# EAGLE design Symposion_K3_Arduino-Peripherie-IF_v2.2 (EAGLE 9.6.2)
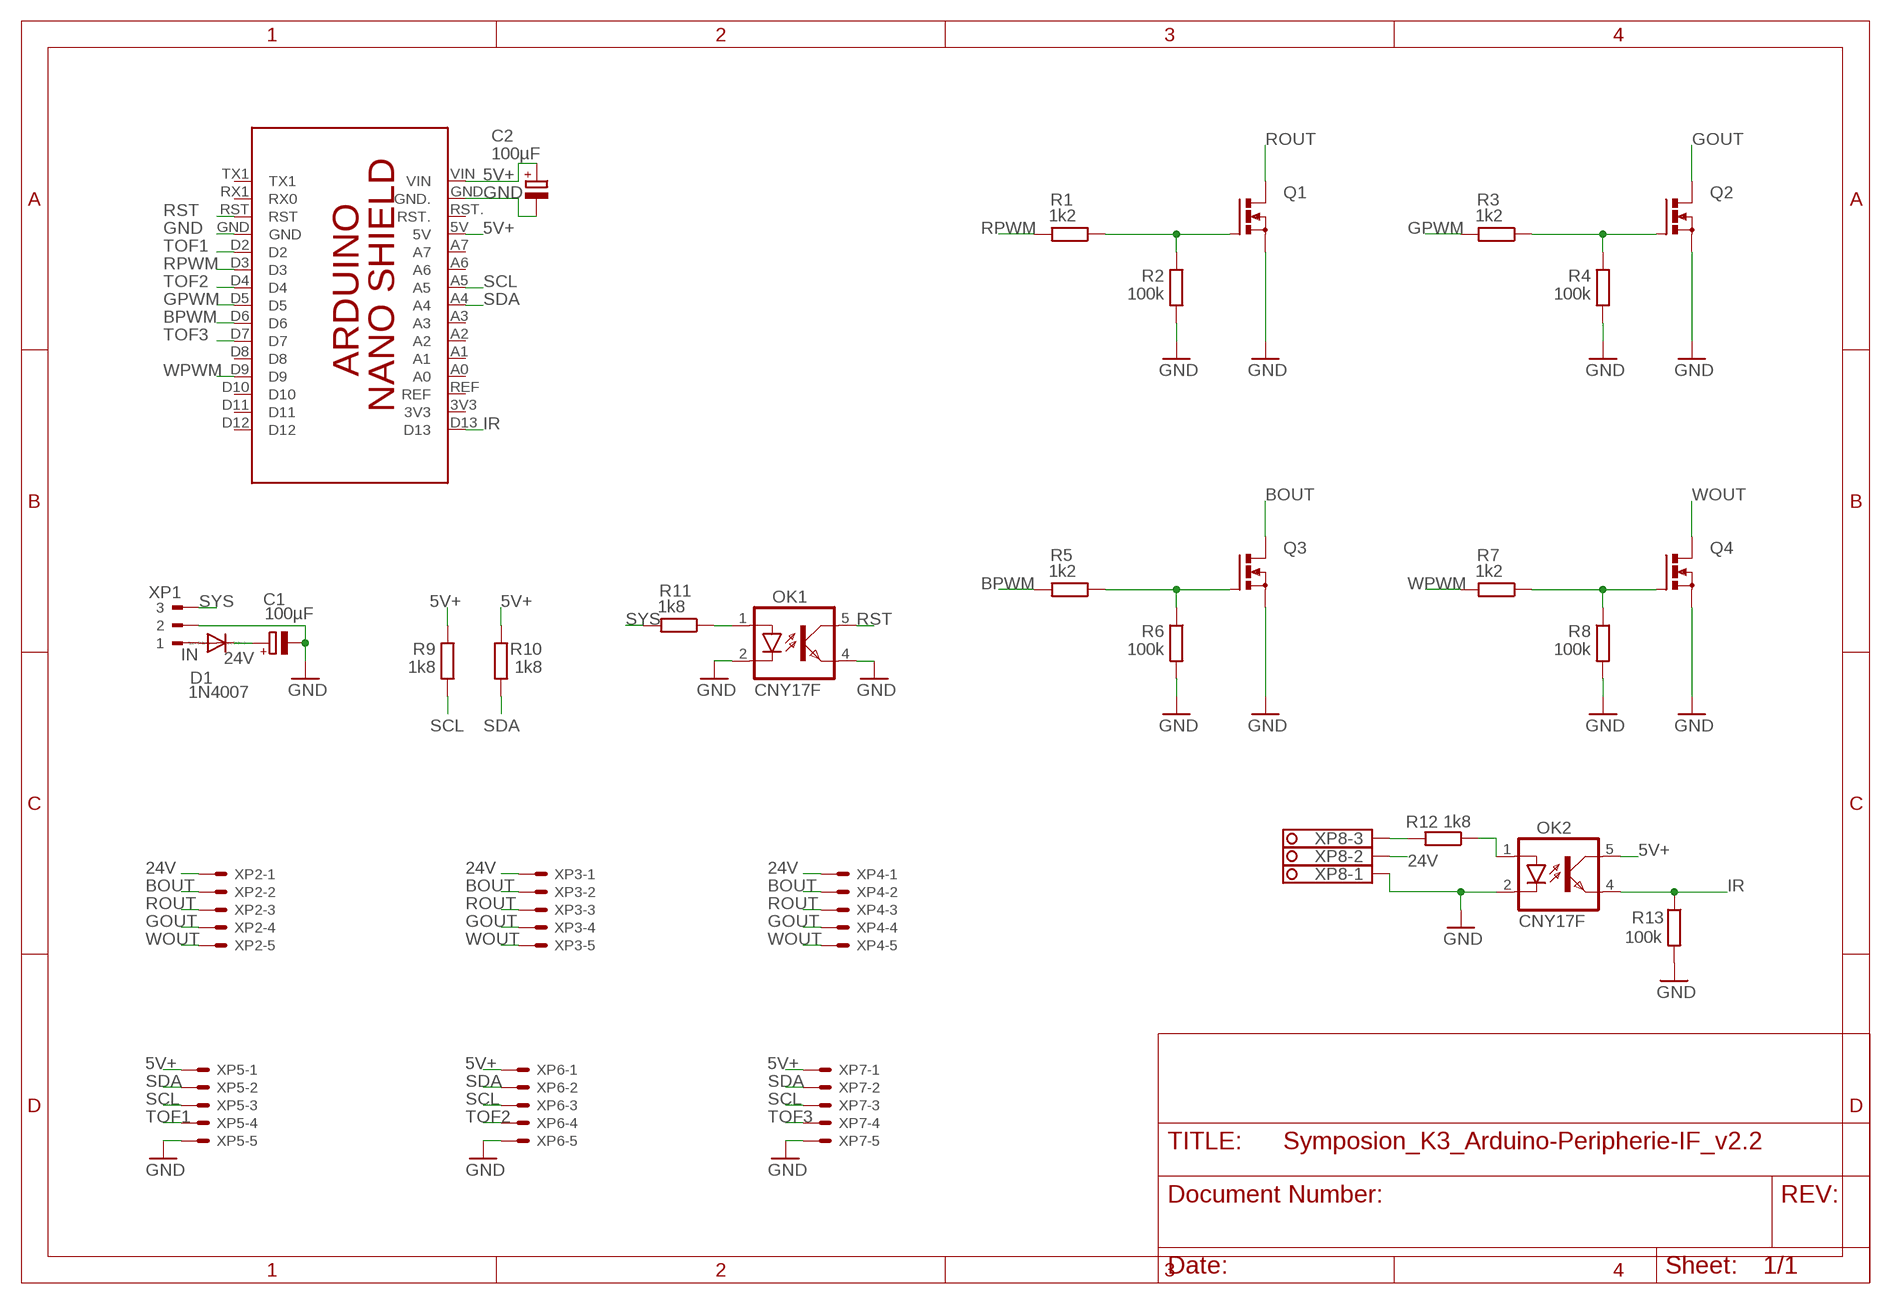
[diagram p0: schematic, sheet 1]

## Parts
C1  100µF  RCL_CPOL-EUE5-6  [RCL_E5-6]
C2  100µF  RCL_CPOL-EUE5-6  [RCL_E5-6]
D1  1N4007  DIODE_DIODE-F126-10  [DIODE_F126-10]
OK1  CNY17F  [DIL06]
OK2  CNY17F  [DIL06]
PCB1  0_WSH_FAVORITES_ARDUINO_NANO  [0_WSH_FAVORITES_ARDUINO_NANO]
Q1  0_WSH_FAVORITES_BUZ11BV  [0_WSH_FAVORITES_TO220BV]
Q2  0_WSH_FAVORITES_BUZ11BV  [0_WSH_FAVORITES_TO220BV]
Q3  0_WSH_FAVORITES_BUZ11BV  [0_WSH_FAVORITES_TO220BV]
Q4  0_WSH_FAVORITES_BUZ11BV  [0_WSH_FAVORITES_TO220BV]
R1  1k2  R-EU_R1206  [R1206]
R2  100k  R-EU_R1206  [R1206]
R3  1k2  R-EU_R1206  [R1206]
R4  100k  R-EU_R1206  [R1206]
R5  1k2  R-EU_R1206  [R1206]
R6  100k  R-EU_R1206  [R1206]
R7  1k2  R-EU_R1206  [R1206]
R8  100k  R-EU_R1206  [R1206]
R9  1k8  R-EU_R1206  [R1206]
R10  1k8  R-EU_R1206  [R1206]
R11  1k8  R-EU_R1206  [R1206]
R12  1k8  R-EU_R1206  [R1206]
R13  100k  R-EU_R1206  [R1206]
XP1  180-3  [180-3]
XP2  22-27-2051-05  [6410-05]
XP3  22-27-2051-05  [6410-05]
XP4  22-27-2051-05  [6410-05]
XP5  22-27-2051-05  [6410-05]
XP6  22-27-2051-05  [6410-05]
XP7  22-27-2051-05  [6410-05]
XP8  1751251  [1751251]

## Nets
5V+: C2.+ OK2.5(COL) PCB1.5V PCB1.VIN R9.1 R10.1 XP5.1 XP6.1 XP7.1
24V: C1.+ D1.C XP2.1 XP3.1 XP4.1 XP8.2
BOUT: Q3.D XP2.2 XP3.2 XP4.2
BPWM: PCB1.D6 R5.2
GND: C1.- C2.- OK1.2(C) OK1.4(EMIT) OK2.2(C) PCB1.GND PCB1.GND. Q1.S Q2.S Q3.S Q4.S R2.2 R4.2 R6.2 R8.2 R13.2 XP1.2 XP5.5 XP6.5 XP7.5 XP8.1
GOUT: Q2.D XP2.4 XP3.4 XP4.4
GPWM: PCB1.D5 R3.2
IN: D1.A XP1.1
IR: OK2.4(EMIT) PCB1.D13 R13.1
N$1: Q1.G R1.1 R2.1
N$2: OK1.1(A) R11.1
N$4: Q2.G R3.1 R4.1
N$7: Q3.G R5.1 R6.1
N$9: OK2.1(A) R12.1
N$10: Q4.G R7.1 R8.1
N$11: R12.2 XP8.3
ROUT: Q1.D XP2.3 XP3.3 XP4.3
RPWM: PCB1.D3 R1.2
RST: OK1.5(COL) PCB1.RST
SCL: PCB1.A5 R9.2 XP5.3 XP6.3 XP7.3
SDA: PCB1.A4 R10.2 XP5.2 XP6.2 XP7.2
SYS: R11.2 XP1.3
TOF1: PCB1.D2 XP5.4
TOF2: PCB1.D4 XP6.4
TOF3: PCB1.D7 XP7.4
WOUT: Q4.D XP2.5 XP3.5 XP4.5
WPWM: PCB1.D9 R7.2
Unconnected: PCB1.3V3 PCB1.A0 PCB1.A1 PCB1.A2 PCB1.A3 PCB1.A6 PCB1.A7 PCB1.D8 PCB1.D10 PCB1.D11 PCB1.D12 PCB1.REF PCB1.RST. PCB1.RX1(RX0) PCB1.TX1

## Library data of the parts
C1 C2 = 20221130_WSH_Eagle_Lib:RCL_CPOL-EU: POLARIZED CAPACITOR, European symbol
D1 = 20221130_WSH_Eagle_Lib:DIODE_DIODE-: DIODE
OK1 OK2 = optocoupler:CNY17F: SIEMENS OPTO COUPLER; MF: VISHAY/TELEFUNKEN; MPN: CNY17F-3; OC_FARNELL: 1469473; OC_NEWARK: 58K0172
PCB1 = 20221130_WSH_Eagle_Lib:0_WSH_FAVORITES_ARDUINO_NANO: Device for representing an Arduino Nano shield
Q1-Q4 = 20221130_WSH_Eagle_Lib:0_WSH_FAVORITES_BUZ11: N-CHANNEL MOS FET
R1-R13 = resistor:R-EU_: RESISTOR, European symbol
XP1 = con-weidmueller-sl35:180-3: WEIDMUELLER CLAMP CONNECTOR; OC_FARNELL: unknown; OC_NEWARK: unknown
XP2-XP7 = con-molex:22-?-05: CONNECTOR wire to board 2.54 mm (.1 inch) pitch header; MF: MOLEX; OC_FARNELL: unknown; OC_NEWARK: unknown
XP8 = con-phoenix-350:1751251: MKDS 1/ 3-3,5 Printklemme Nennstrom: 10 A Bemessungsspannung: 160 V Raster: 3,5 mm Polzahl: 3 Montageart: Löten Anschlussart: Schraubanschluss Anschlussrichtung vom Leiter zur Platine: 0° Source: http://eshop.phoenixcontact.com .. 1751251.pdf; OC_FARNELL: unknown; OC_NEWARK: unknown

## Board
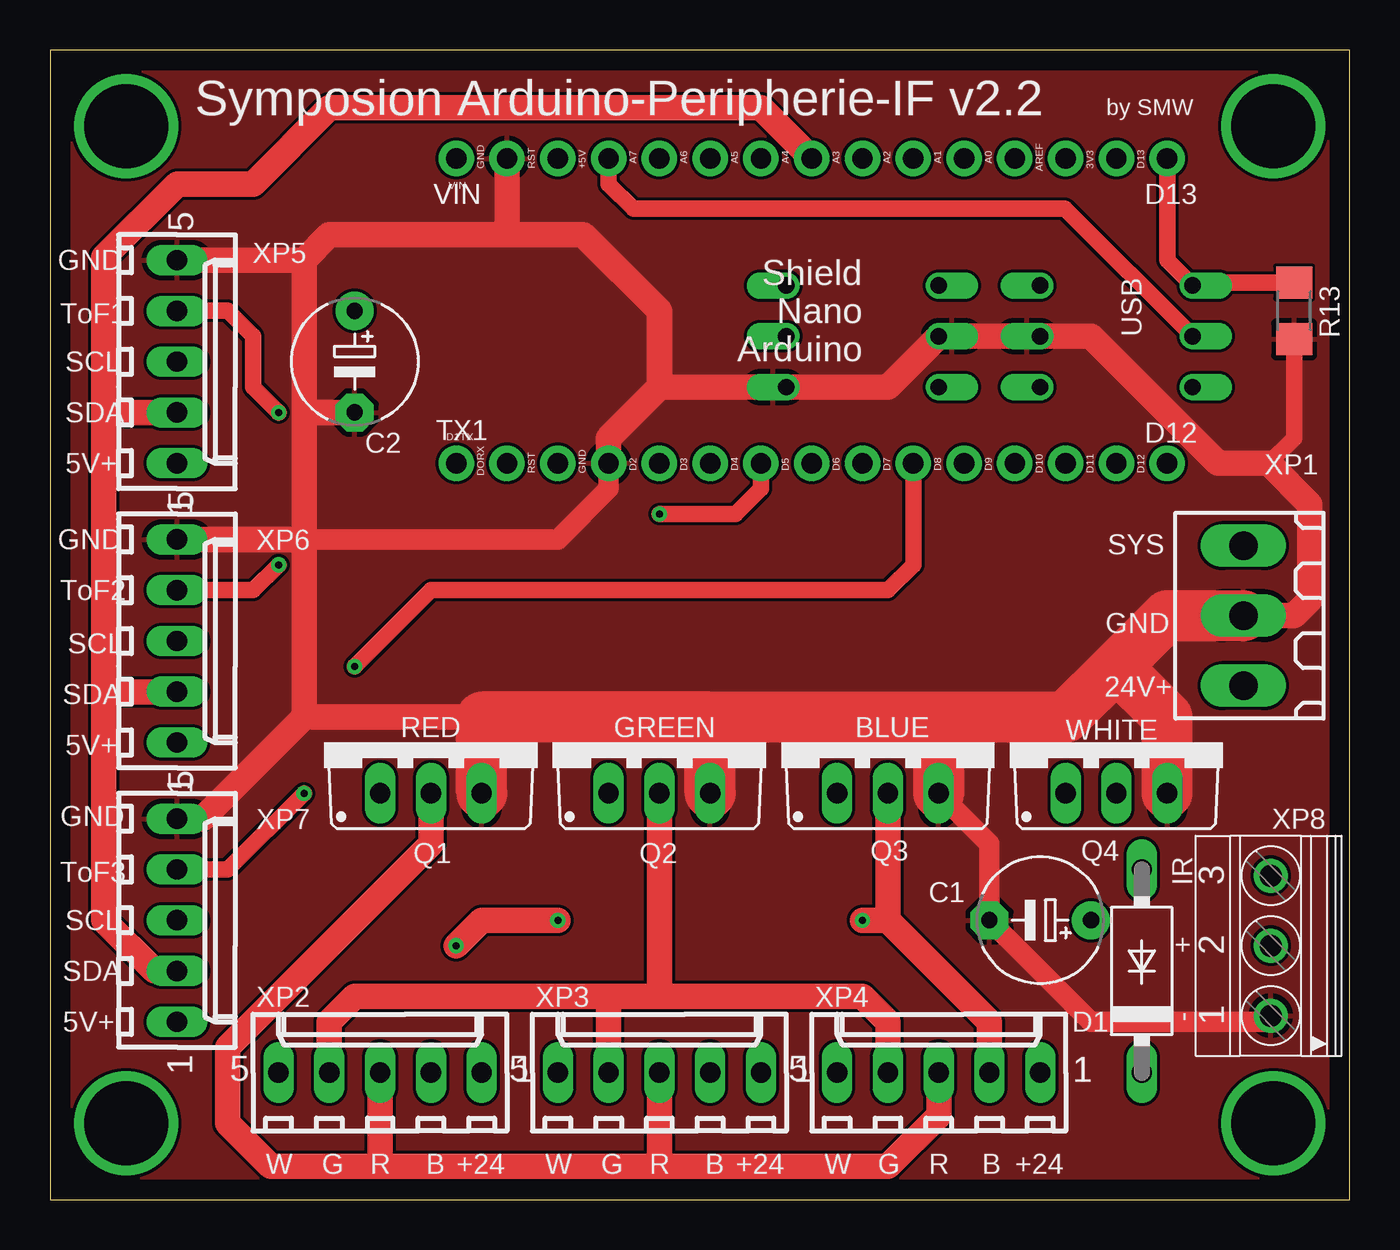
[diagram p1: board, top side]
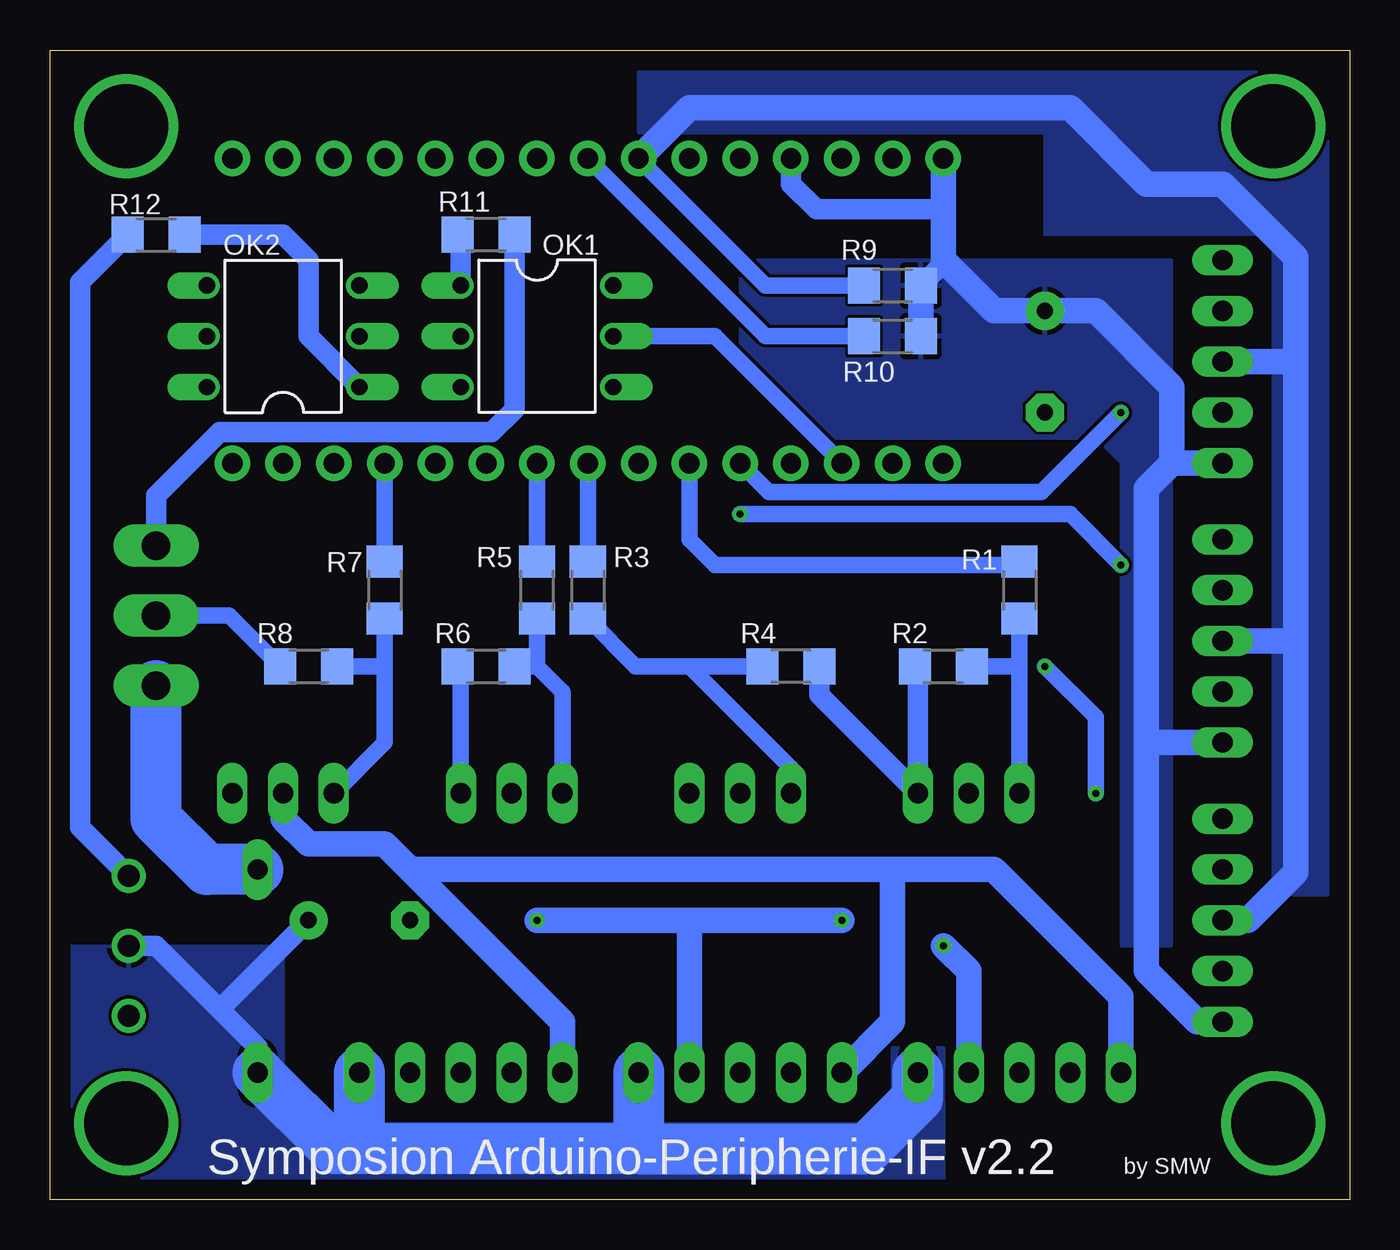
[diagram p2: board, bottom side, seen from below]

Size 65 x 57.5 mm. Coordinates in mm from the lower left corner, seen from the top.
Outline: 0,0 65,0 65,57.5 0,57.5 0,0
Copper layers (1*16): Top 0.035mm / dielectric 1.5mm / Bottom 0.035mm
Design rules "default": minimum track width 6mil, minimum drill 0.35mm, track to track 6mil, track to pad 6mil, pad to pad 6mil, via to via 6mil, smd to smd 6mil, copper to edge 40mil, drill to drill 6mil, minimum pad ring 10mil, minimum via ring 8mil, stop-mask expansion 4mil, vias tented up to drill 0mil, thermal gap 10mil

### Footprints (pad centres in the part's own frame; a part is rotated, then mirrored left to right if it is on the bottom)
RCL_E5-6 = drill 0.813 pad 1.905: + -2.54,0 | drill 0.813 pad 1.905 octagon: - 2.54,0
DIODE_F126-10 = drill 1.016 long: A 5.08,0; C -5.08,0
DIL06 = drill 0.813 offset: 1 -2.54,-3.81; 2 0,-3.81; 3 2.54,-3.81; 4 2.54,3.81; 5 0,3.81; 6 -2.54,3.81
0_WSH_FAVORITES_ARDUINO_NANO = drill 1.016 pad 1.778: 3V3 6.35,1.27; 5V 31.75,1.27; A0 11.43,1.27; A1 13.97,1.27; A2 16.51,1.27; A3 19.05,1.27; A4 21.59,1.27; A5 24.13,1.27; A6 26.67,1.27; A7 29.21,1.27; D2 29.21,16.51; D3 26.67,16.51; D4 24.13,16.51; D5 21.59,16.51; D6 19.05,16.51; D7 16.51,16.51; D8 13.97,16.51; D9 11.43,16.51; D10 8.89,16.51; D11 6.35,16.51; D12 3.81,16.51; D13 3.81,1.27; GND 31.75,16.51; GND. 36.83,1.27; REF 8.89,1.27; RST 34.29,16.51; RST. 34.29,1.27; RX1 36.83,16.51; TX1 39.37,16.51; VIN 39.37,1.27
0_WSH_FAVORITES_TO220BV = drill 1.016 long: D 0,-2.54; G -2.54,-2.54; S 2.54,-2.54
R1206 = smd 1.6 x 1.803: 1 -1.422,0; 2 1.422,0
180-3 = drill 1.422 long: 1 -3.5,0; 2 0,0; 3 3.5,0
6410-05 = drill 1.016 long: 1 5.08,0; 2 2.54,0; 3 0,0; 4 -2.54,0; 5 -5.08,0
1751251 = drill 1.1 pad 1.7: 1 -3.5,-0.1; 2 0,-0.1; 3 3.5,-0.1

### Placement (x,y rotation side)
C1  49.53,13.97 180 top
C2  15.24,41.91 270 top
D1  54.61,11.43 90 top
OK1  40.64,43.18 270 bottom
OK2  53.34,43.18 90 bottom
PCB1  59.69,53.34 180 top
Q1  19.05,22.86 0 top
Q2  30.48,22.86 0 top
Q3  41.91,22.86 0 top
Q4  53.34,22.86 0 top
R1  16.51,30.48 90 bottom
R2  20.32,26.67 180 bottom
R3  38.1,30.48 90 bottom
R4  27.94,26.67 0 bottom
R5  40.64,30.48 90 bottom
R6  43.18,26.67 180 bottom
R7  48.26,30.48 90 bottom
R8  52.07,26.67 180 bottom
R9  22.86,45.72 180 bottom
R10  22.86,43.18 180 bottom
R11  43.18,48.26 0 bottom
R12  59.69,48.26 180 bottom
R13  62.23,44.45 270 top
XP1  59.69,29.21 90 top
XP2  16.51,6.35 0 top
XP3  30.48,6.35 0 top
XP4  44.45,6.35 0 top
XP5  6.35,41.91 270 top
XP6  6.35,27.94 270 top
XP7  6.35,13.97 270 top
XP8  60.96,12.7 90 top

### Tracks (layer width: path | path; a pad name or v marks a point on that pad's centre or on a via)
5V+
  Top 0.813: PCB1.5V 27.94,50.8 29.18,49.55 50.77,49.55 OK2.5
  Bottom 1.016: PCB1.5V 27.94,50.8 26.67,49.53 20.32,49.53 | 20.24,46.91 R9.1 20.32,46.84 20.32,46.99
  Bottom 1.27: R9.1 R10.1 | PCB1.VIN 20.32,49.53 20.32,46.99 | XP5.1 8.89,36.83 | 10.16,22.86 10.16,35.56 8.89,36.83 | 10.16,22.86 10.16,11.43 7.62,8.89 XP7.1 | XP6.1 10.16,22.86 | 20.24,46.91 17.78,44.45 C2.+ 12.7,44.45 8.89,40.64 8.89,36.83
  pour Bottom: 30.48,46.99 30.48,39.37 29.21,38.1 12.7,38.1 11.43,36.83 11.43,12.7 8.89,12.7 8.89,46.99
24V
  Bottom 1.016: C1.+ 56.52,9.53 | D1.C 54.61,7.62 56.52,9.53 | XP8.2 59.69,12.7 56.52,9.53
  Bottom 2.54: XP4.1 49.53,2.54 | 35.56,2.54 49.53,2.54 | 35.56,2.54 24.13,2.54 21.59,5.08 XP2.1 | XP3.1 35.56,2.54 | 49.53,2.54 50.8,2.54 D1.C
  pour Bottom: 20.32,0 64.77,0 64.77,12.7 53.34,12.7 53.34,3.81 22.86,3.81 22.86,7.62 20.32,7.62
BOUT  (via drill 0.35)
  Top 1.27: Q3.D 41.91,13.97 | v20.32,12.7 21.59,13.97 v25.4,13.97 | 41.91,13.97 v40.64,13.97 | 41.91,13.97 46.99,8.89 XP4.2
  Bottom 1.27: XP2.2 19.05,11.43 v20.32,12.7 | v25.4,13.97 33.02,13.97 | 33.02,13.97 XP3.2 | v40.64,13.97 33.02,13.97
BPWM
  Bottom 0.813: PCB1.D6 R5.2
GND
  Top 0.813: R13.2 62.23,38.1 60.96,36.83
  Top 1.016: 7.62,19.05 XP7.5 | PCB1.GND 27.94,35.56 25.4,33.02 12.7,33.02 | Q3.S 46.99,17.78 C1.- 52.07,8.89 60.75,8.89 XP8.1
  Top 1.27: 12.7,46.99 12.7,39.37 | 12.7,39.37 12.7,33.02 | XP5.5 12.7,46.99 | XP6.5 12.7,33.02 | 12.7,24.13 7.62,19.05 | XP1.2 62.23,29.21 63.02,30 63.02,34.77 60.96,36.83 58.42,36.83 52.07,43.18 OK2.2 OK1.2 41.91,40.64 OK1.4 30.48,40.64 | 22.86,48.26 13.97,48.26 12.7,46.99 | 12.7,33.02 12.7,24.13 | PCB1.GND. 22.86,48.26 | C2.- 12.7,39.37 | PCB1.GND 27.94,38.1 30.48,40.64 | 22.86,48.26 26.67,48.26 30.48,44.45 30.48,40.64 | 12.7,24.13 21.59,24.13
  Top 2.54: 33.02,24.13 44.45,24.13 | 44.45,24.13 50.8,24.13 53.34,26.67 | Q3.S 44.45,24.13 | Q2.S 33.02,24.13 | Q4.S 55.88,24.13 53.34,26.67 | 53.34,26.67 55.88,29.21 XP1.2 | 33.02,24.13 21.59,24.13 Q1.S
  Bottom 0.61: R6.2 44.45,26.52
  Bottom 0.813: R8.2 56.03,29.21 XP1.2 | 44.45,26.52 Q3.S
  Bottom 1.016: R2.2 21.59,26.52 Q1.S 26.52,25.25 R4.2
  pour Top: 0,0 0,57.28 0.13,57.4 65.02,57.4 65.02,0.13 65.15,0
GOUT
  Top 1.27: 30.48,10.16 27.94,10.16 | 27.94,10.16 15.24,10.16 13.97,8.89 XP2.4 | 27.94,10.16 XP3.4 | 30.48,10.16 40.64,10.16 41.91,8.89 XP4.4 | Q2.D 30.48,10.16
GPWM
  Bottom 0.813: R3.2 PCB1.D5
IN
  Bottom 2.54: D1.A 57.15,16.51 59.69,19.05 XP1.1
IR
  Top 0.813: R13.1 57.3,45.87 OK2.4 55.88,46.99 PCB1.D13
N$1
  Bottom 0.813: Q1.G 16.51,26.67 | 16.51,26.67 R1.1 | R2.1 16.51,26.67
N$2
  Bottom 1.016: OK1.1 44.45,48.11 R11.1
N$3  (via drill 4.2 pad 5)
  other vias: 3.81,53.69
N$4
  Bottom 0.813: Q2.G 27.94,21.59 33.02,26.67 | 33.02,26.67 R4.1 | R3.1 35.71,26.67 33.02,26.67
N$5  (via drill 4.2 pad 5)
  other vias: 61.19,3.81
N$6  (via drill 4.2 pad 5)
  other vias: 3.81,3.81
N$7
  Bottom 0.813: Q3.G 39.37,25.4 40.64,26.67 | R6.1 40.64,26.67 | R5.1 40.64,26.67
N$8  (via drill 4.2 pad 5)
  other vias: 61.19,53.69
N$9
  Bottom 1.016: R12.1 53.34,48.26 52.07,46.99 52.07,43.18 OK2.1
N$10
  Bottom 0.813: Q4.G 48.26,22.86 48.26,26.67 | 48.26,26.67 R7.1 | R8.1 48.26,26.67
N$11
  Bottom 1.016: R12.2 63.48,45.9 63.48,18.62 XP8.3
ROUT
  Top 1.27: Q1.D 19.05,17.78 8.89,7.62 8.89,3.81 11.05,1.65 16.51,1.65 | 16.51,1.65 30.48,1.65 | XP3.3 30.48,1.65 | XP2.3 16.51,1.65 | 30.48,1.65 41.91,1.65 44.45,4.19 XP4.3
RPWM
  Bottom 0.61: R1.2 16.66,31.75
  Bottom 0.813: 16.66,31.75 31.75,31.75 33.02,33.02 PCB1.D3
RST
  Bottom 0.813: PCB1.RST 31.75,43.18 OK1.5
SCL
  Bottom 0.813: R9.2 29.21,45.72 PCB1.A5
  Bottom 1.27: XP5.3 2.69,41.91 | XP6.3 2.69,27.94 | 2.69,41.91 2.69,27.94 | 2.69,27.94 2.69,16.36 5.08,13.97 XP7.3 | 2.69,41.91 2.69,47.14 6.35,50.8 10.16,50.8 13.97,54.61 33.02,54.61 PCB1.A5
  pour Bottom: 0,15.24 3.81,15.24 3.81,48.26 15.24,48.26 15.24,53.34 35.56,53.34 35.56,57.15 0,57.15
SDA
  Top 1.27: 2.69,25.4 2.69,13.97 5.23,11.43 XP7.2 | XP6.2 2.69,25.4 | XP5.2 2.69,39.37 | 2.69,39.37 2.69,25.4 | 2.69,39.37 2.69,47.14 6.35,50.8 10.16,50.8 13.97,54.61 35.56,54.61 PCB1.A4
  Bottom 0.813: R10.2 29.21,43.18 PCB1.A4
SYS
  Bottom 1.016: R11.2 41.76,39.52 42.9,38.38 56.52,38.38 59.69,35.21 XP1.3
TOF1  (via drill 0.35)
  Top 0.813: v11.43,39.37 10.16,40.64 10.16,43.18 8.89,44.45 XP5.4
  Bottom 0.813: v11.43,39.37 15.42,35.38 29.03,35.38 PCB1.D2
TOF2  (via drill 0.35)
  Top 0.813: XP6.4 10.16,30.48 v11.43,31.75 | v30.48,34.29 34.29,34.29 35.56,35.56 PCB1.D4
  Bottom 0.813: v30.48,34.29 13.97,34.29 v11.43,31.75
TOF3  (via drill 0.35)
  Top 0.813: v15.24,26.67 19.05,30.48 41.91,30.48 43.18,31.75 PCB1.D7 | XP7.4 8.89,16.51 v12.7,20.32
  Bottom 0.813: v12.7,20.32 12.7,24.13 v15.24,26.67
WOUT
  Bottom 1.27: XP2.5 11.43,10.16 17.78,16.51 22.86,16.51 | XP3.5 22.86,8.89 22.86,16.51 | Q4.D 53.34,19.05 52.07,17.78 48.26,17.78 46.99,16.51 | 22.86,16.51 46.99,16.51 | XP4.5 39.37,8.89 46.99,16.51
WPWM
  Bottom 0.813: R7.2 PCB1.D9

### Text on the board
tNames: Symposion Arduino-Peripherie-IF v2.2 | by SMW | VIN | VIN | D13 | GND | ToF1 | USB | SCL | SDA | TX1 | D12 | 5V+ | GND | SYS | ToF2 | GND | SCL | 24V+ | SDA | RED | GREEN | BLUE | WHITE | 5V+ | GND | IR | ToF3 | SCL | + | SDA | - | 5V+ | W | G | R | B | +24 | W | G | R | B | +24 | W | G | R | B | +24
bNames: by SMW | Symposion Arduino-Peripherie-IF v2.2